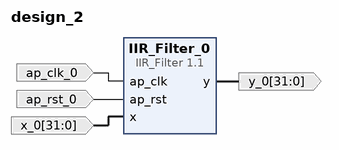
[diagram p0: block diagram of the top level]
# Vivado block design design_2, xc7a35tcpg236-1, Vivado 2019.2
create_bd_design design_2

create_bd_port -dir I -type clk ap_clk_0
create_bd_port -dir I -type rst ap_rst_0
set_property -dict {CONFIG.POLARITY ACTIVE_HIGH} [get_bd_ports ap_rst_0]
create_bd_port -dir I -from 31 -to 0 -type data x_0
create_bd_port -dir O -from 31 -to 0 -type data y_0

create_bd_cell -type ip -vlnv Xilinx:hls:IIR_Filter:1.1 IIR_Filter_0

# ---- connections ----

connect_bd_net -net ap_clk_0_1 [get_bd_ports ap_clk_0] [get_bd_pins IIR_Filter_0/ap_clk]
connect_bd_net -net ap_rst_0_1 [get_bd_ports ap_rst_0] [get_bd_pins IIR_Filter_0/ap_rst]
connect_bd_net -net x_0_1 [get_bd_ports x_0] [get_bd_pins IIR_Filter_0/x]
connect_bd_net [get_bd_pins IIR_Filter_0/y] [get_bd_ports y_0]

validate_bd_design
save_bd_design
